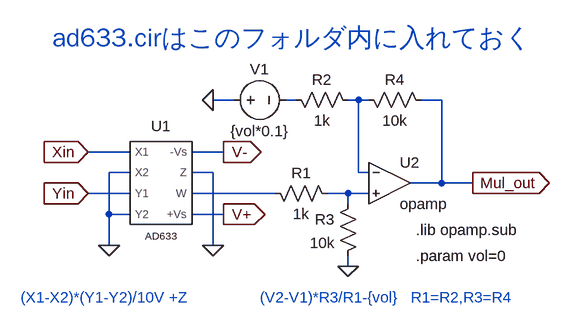
[diagram p0: schematic mul_lv2.asc]
mul_lv2.asc, the LTspice schematic file:
Version 4.1
SHEET 1 880 680
WIRE 208 16 176 16
WIRE 304 16 288 16
WIRE 400 16 384 16
WIRE 416 16 400 16
WIRE 528 16 496 16
WIRE 48 96 -16 96
WIRE 192 96 144 96
WIRE 48 128 16 128
WIRE 176 128 144 128
WIRE 400 128 400 16
WIRE 416 128 400 128
WIRE 528 144 528 16
WIRE 528 144 480 144
WIRE 576 144 528 144
WIRE 48 160 -16 160
WIRE 272 160 144 160
WIRE 384 160 352 160
WIRE 416 160 384 160
WIRE 384 176 384 160
WIRE 16 192 16 128
WIRE 48 192 16 192
WIRE 192 192 144 192
WIRE 16 240 16 192
WIRE 176 240 176 128
WIRE 384 272 384 256
FLAG 576 144 Mul_out
IOPIN 576 144 Out
FLAG 384 272 0
FLAG 192 192 V+
IOPIN 192 192 Out
FLAG 192 96 V-
IOPIN 192 96 Out
FLAG -16 96 Xin
IOPIN -16 96 In
FLAG -16 160 Yin
IOPIN -16 160 In
FLAG 16 240 0
FLAG 176 240 0
FLAG 176 16 0
SYMBOL res 256 144 M90
WINDOW 0 0 56 VBottom 2
WINDOW 3 32 56 VTop 2
SYMATTR InstName R1
SYMATTR Value 1k
SYMBOL res 288 0 M90
WINDOW 0 0 56 VBottom 2
WINDOW 3 32 56 VTop 2
SYMATTR InstName R2
SYMATTR Value 1k
SYMBOL res 400 160 M0
SYMATTR InstName R3
SYMATTR Value 10k
SYMBOL res 400 0 M90
WINDOW 0 0 56 VBottom 2
WINDOW 3 32 56 VTop 2
SYMATTR InstName R4
SYMATTR Value 10k
SYMBOL OpAmps\\opamp 448 80 R0
SYMATTR InstName U2
SYMBOL voltage 192 16 M90
WINDOW 0 -32 56 VBottom 2
WINDOW 3 32 56 VTop 2
WINDOW 123 0 0 Left 0
WINDOW 39 0 0 Left 0
SYMATTR InstName V1
SYMATTR Value {vol*0.1}
SYMBOL AD633 80 144 R0
SYMATTR InstName U1
TEXT -120 320 Left 2 ;(X1-X2)*(Y1-Y2)/10V +Z
TEXT 248 320 Left 2 ;(V2-V1)*R3/R1-{vol}   R1=R2,R3=R4
TEXT 488 256 Left 2 !.param vol=0
TEXT 488 216 Left 2 !.lib opamp.sub
TEXT -72 -80 Left 4 ;ad633.cirはこのフォルダ内に入れておく

The netlist it stands for:
* mul_lv2.asc
R1 N003 N004 1k
R2 N001 N002 1k
R3 N004 0 10k
R4 N002 Mul_out 10k
X§U2 N002 N004 Mul_out opamp Aol=100K GBW=10Meg  ; pins invin noninvin out
V1 0 N001 {vol*0.1}
X§U1 Xin 0 Yin 0 V- 0 N003 V+ AD633  ; pins X1 X2 Y1 Y2 -Vs Z W +Vs
* (X1-X2)*(Y1-Y2)/10V +Z
* (V2-V1)*R3/R1-{vol}   R1=R2,R3=R4
.param vol=0
.lib opamp.sub
* ad633.cirはこのフォルダ内に入れておく
.lib ad633.cir
.backanno
.end